# Altium schematic sheet 1ch motor drive.SchDoc
size A; SheetNumber: 2; SheetTotal: 2
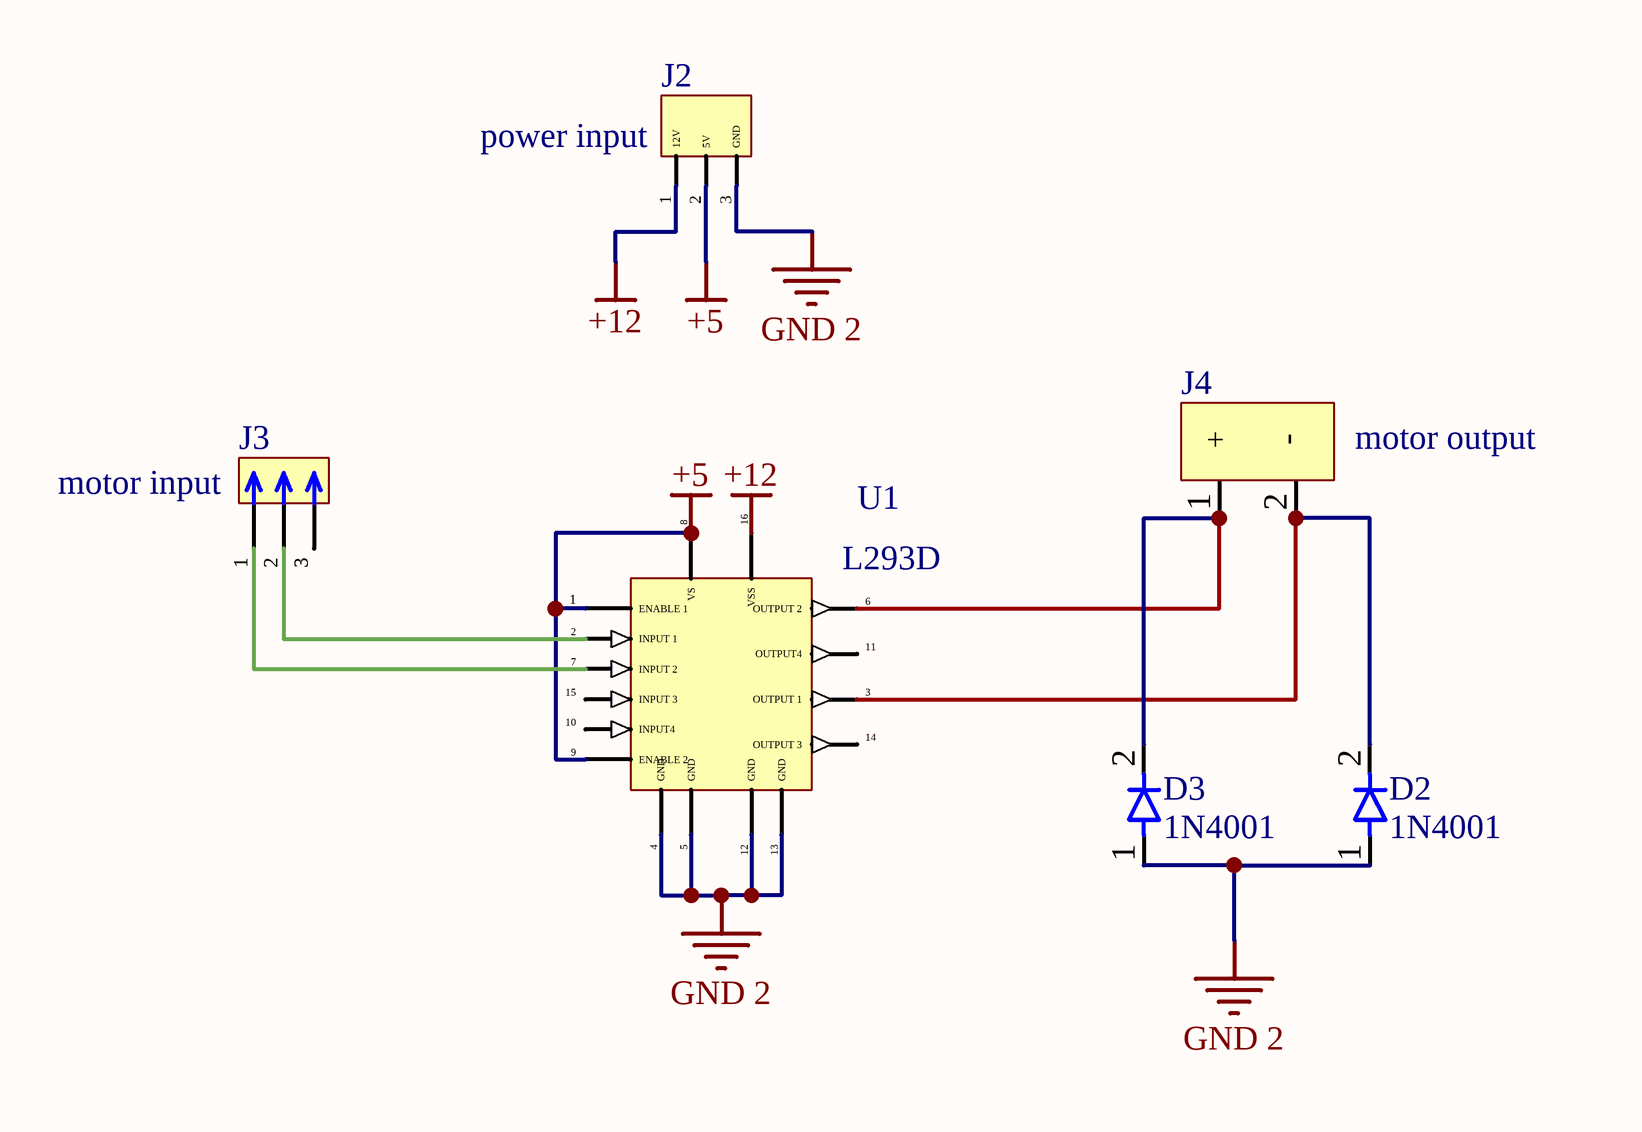
[diagram p0: 1ch motor drive.SchDoc]

## Parts
D2  1N4001  [330ohm_TH]
D3  1N4001  [330ohm_TH]
J2  power input  [TERMINAL BLOCK 3PIN]
J3  motor input  [pin header male]
J4  motor output  [header]
U1  L293D  [L293D]

## Nets
+5: J2.2(5V) U1.1(ENABLE_1) U1.8(VS) U1.9(ENABLE_2)
+12: J2.1(12V) U1.16(VSS)
GND 2: D2.1 D3.1 J2.3(GND) U1.4(GND) U1.5(GND) U1.12(GND) U1.13(GND)
NetD2_2: D2.2 J4.2 U1.3(OUTPUT_1)
NetD3_2: D3.2 J4.1 U1.6(OUTPUT_2)
NetJ3_1: J3.1 U1.7(INPUT_2)
NetJ3_2: J3.2 U1.2(INPUT_1)

Not connected (* = marked no-connect by the designer): J3 3; U1 10(INPUT4) 11(OUTPUT4) 14(OUTPUT_3) 15(INPUT_3)

## Notes on the sheet
- (in symbol terminal block_TH) -; +

## Library data of the parts
D2 D3 = diode: Forward Voltage: 1.1 V; Maximum Full Load Reverse Current,: 30 μA; Reverse Current at Rated V: 5.0 μA; Power Dissipation: 3.0 W
J2 = 3pin terminal block
J3 = pin header male
J4 = terminal block_TH